# EAGLE design smd-to-breadboard2 (EAGLE 7.6.0)
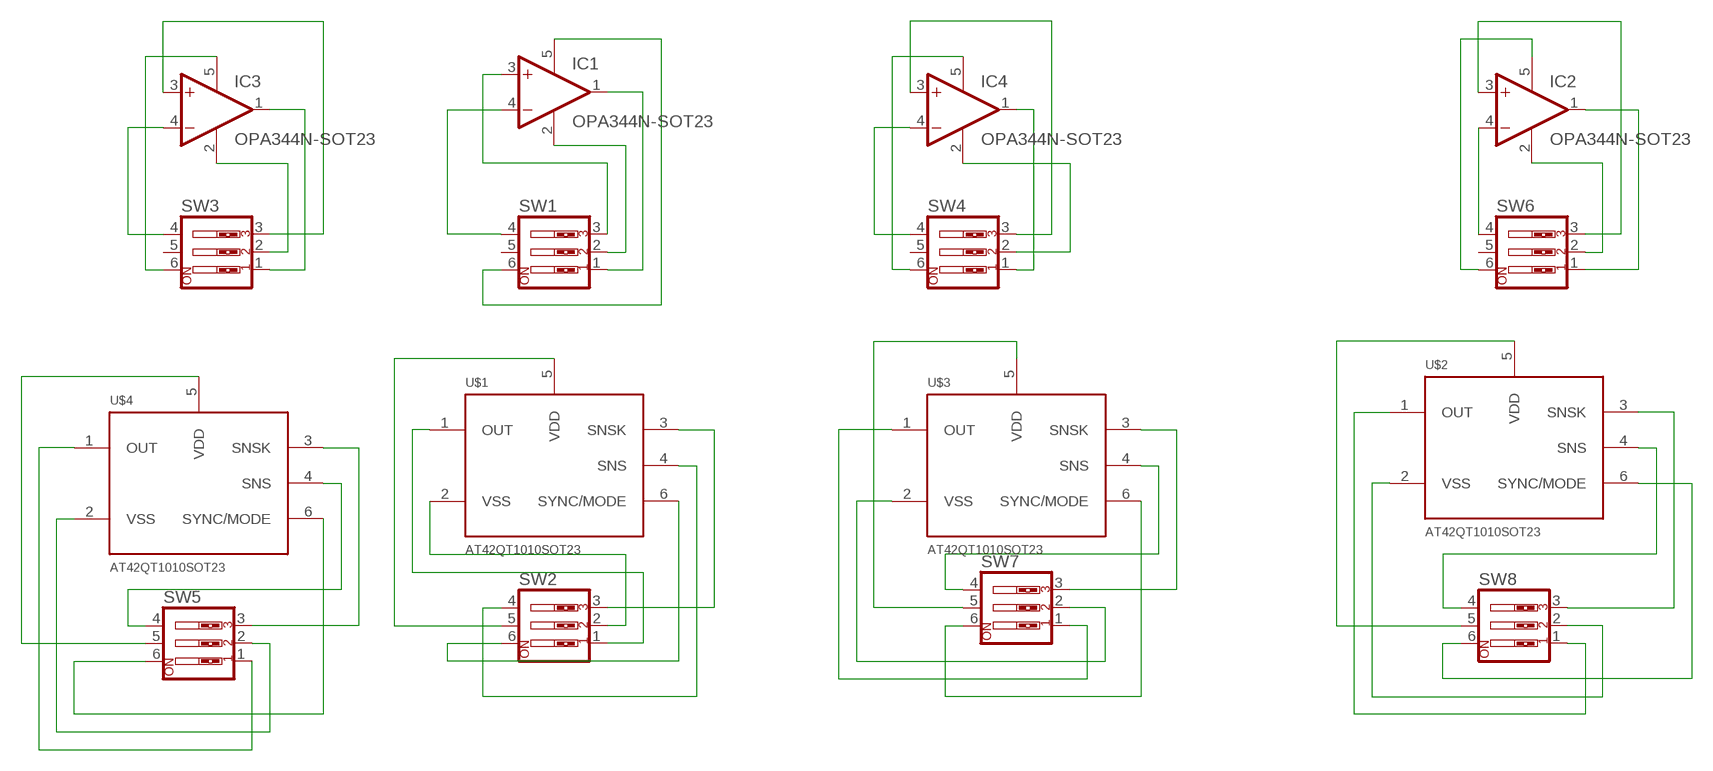
[diagram p0: schematic, sheet 1]

## Parts
IC1  OPA344N-SOT23  [SOT23-5]
IC2  OPA344N-SOT23  [SOT23-5]
IC3  OPA344N-SOT23  [SOT23-5]
IC4  OPA344N-SOT23  [SOT23-5]
SW1  SW_DIP-3  [EDG-03]
SW2  SW_DIP-3  [EDG-03]
SW3  SW_DIP-3  [EDG-03]
SW4  SW_DIP-3  [EDG-03]
SW5  SW_DIP-3  [EDG-03]
SW6  SW_DIP-3  [EDG-03]
SW7  SW_DIP-3  [EDG-03]
SW8  SW_DIP-3  [EDG-03]
U$1  AT42QT1010SOT23  [SOT23-6]
U$2  AT42QT1010SOT23  [SOT23-6]
U$3  AT42QT1010SOT23  [SOT23-6]
U$4  AT42QT1010SOT23  [SOT23-6]

## Nets
N$1: IC3.1(OUT) SW3.1
N$2: IC3.2(V-) SW3.2
N$3: IC3.3(+IN) SW3.3
N$4: IC3.5(V+) SW3.6
N$5: IC3.4(-IN) SW3.4
N$6: IC4.3(+IN) SW4.3
N$7: IC4.5(V+) SW4.6
N$8: IC4.4(-IN) SW4.4
N$9: IC4.1(OUT) SW4.1
N$10: IC1.1(OUT) SW1.1
N$11: IC1.2(V-) SW1.2
N$12: IC1.5(V+) SW1.6
N$13: IC1.3(+IN) SW1.3
N$14: IC1.4(-IN) SW1.4
N$15: SW2.1 U$1.1(OUT)
N$16: SW2.6 U$1.6(SYNC/MODE)
N$17: SW2.2 U$1.2(VSS)
N$18: SW2.4 U$1.4(SNS)
N$19: SW2.5 U$1.5(VDD)
N$20: SW2.3 U$1.3(SNSK)
N$21: IC4.2(V-) SW4.2
N$22: IC2.4(-IN) SW6.4
N$23: IC2.5(V+) SW6.6
N$24: IC2.3(+IN) SW6.3
N$25: IC2.1(OUT) SW6.1
N$26: IC2.2(V-) SW6.2
N$27: SW5.1 U$4.1(OUT)
N$28: SW5.2 U$4.2(VSS)
N$29: SW5.5 U$4.5(VDD)
N$30: SW5.6 U$4.6(SYNC/MODE)
N$31: SW5.4 U$4.4(SNS)
N$32: SW5.3 U$4.3(SNSK)
N$33: SW7.1 U$3.1(OUT)
N$34: SW7.2 U$3.2(VSS)
N$35: SW7.6 U$3.6(SYNC/MODE)
N$36: SW7.5 U$3.5(VDD)
N$37: SW7.4 U$3.4(SNS)
N$38: SW7.3 U$3.3(SNSK)
N$39: SW8.1 U$2.1(OUT)
N$40: SW8.2 U$2.2(VSS)
N$41: SW8.3 U$2.3(SNSK)
N$42: SW8.4 U$2.4(SNS)
N$43: SW8.5 U$2.5(VDD)
N$44: SW8.6 U$2.6(SYNC/MODE)
Unconnected: SW1.5 SW3.5 SW4.5 SW6.5

## Library data of the parts
IC1-IC4 = linear:OPA*-SOT23: Single Operational Amplifier Low Power, Single-Supply, Rail-To-Rail Operational Amplifier Source: http://focus.ti.com/lit/ds/symlink/opa2345.pdf
SW1-SW8 = special:SW_DIP-3: DIP SWITCH
U$1-U$4 = SparkFun-DigitalIC:AT42QT1010

## Board
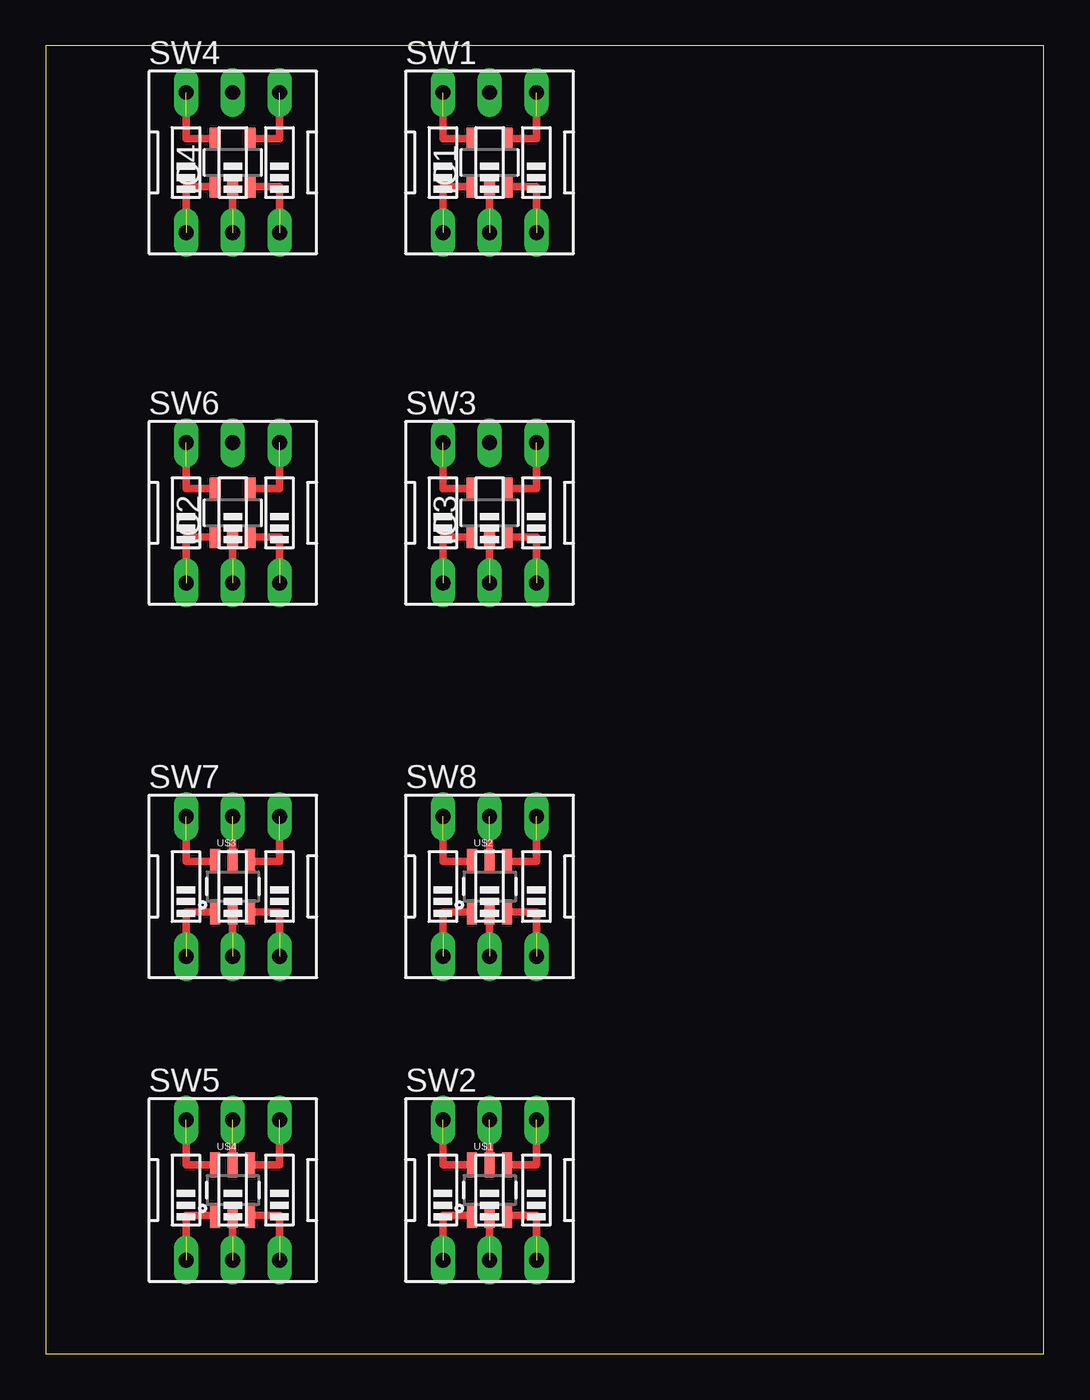
[diagram p1: board, top side]

Size 54.28 x 71.11 mm. Coordinates in mm from the lower left corner, seen from the top.
Outline: 0,0 54.28,0 54.28,71.11 0,71.11 0,0
Copper layers (1*16): Top 0.035mm / dielectric 1.5mm / Bottom 0.035mm
Design rules "default": minimum track width 10mil, minimum drill 24mil, track to track 8mil, track to pad 8mil, pad to pad 8mil, via to via 8mil, smd to smd 8mil, copper to edge 40mil, drill to drill 8mil, minimum pad ring 10mil, minimum via ring 8mil, stop-mask expansion 4mil, vias tented up to drill 0mil, thermal gap 10mil

### Footprints (pad centres in the part's own frame; a part is rotated, then mirrored left to right if it is on the bottom)
SOT23-5 = smd 0.6 x 1.2: 1 -0.95,-1.306; 2 0,-1.306; 3 0.95,-1.306; 4 0.95,1.306; 5 -0.95,1.306
EDG-03 = drill 0.813 long: 1 -2.54,-3.81; 2 0,-3.81; 3 2.54,-3.81; 4 2.54,3.81; 5 0,3.81; 6 -2.54,3.81
SOT23-6 = smd 0.55 x 1.35: 1 -0.95,-1.375; 2 0,-1.375; 3 0.95,-1.375; 4 0.95,1.375; 5 0,1.375; 6 -0.95,1.375

### Placement (x,y rotation side)
IC1  24.13,64.77 0 top
IC2  10.16,45.72 0 top
IC3  24.13,45.72 0 top
IC4  10.16,64.77 0 top
SW1  24.13,64.77 0 top
SW2  24.13,8.89 0 top
SW3  24.13,45.72 0 top
SW4  10.16,64.77 0 top
SW5  10.16,8.89 0 top
SW6  10.16,45.72 0 top
SW7  10.16,25.4 0 top
SW8  24.13,25.4 0 top
U$1  24.13,8.89 0 top
U$2  24.13,25.4 0 top
U$3  10.16,25.4 0 top
U$4  10.16,8.89 0 top

### Tracks (layer width: path | path; a pad name or v marks a point on that pad's centre or on a via)
N$1  (1 unrouted)
  Top 0.406: IC3.1 21.59,44.41 21.59,43.18
N$2  (1 unrouted)
  Top 0.406: IC3.2 24.13,43.18
N$3  (1 unrouted)
  Top 0.406: IC3.3 26.67,44.41 26.67,43.18
N$4  (1 unrouted)
  Top 0.406: IC3.5 21.59,47.03 21.59,48.26
N$5  (1 unrouted)
  Top 0.406: IC3.4 26.67,47.03 26.67,48.26
N$6  (1 unrouted)
  Top 0.406: IC4.3 12.7,63.46 12.7,62.23
N$7  (1 unrouted)
  Top 0.406: IC4.5 7.62,66.08 7.62,67.31
N$8  (1 unrouted)
  Top 0.406: IC4.4 12.7,66.08 12.7,67.31
N$9  (1 unrouted)
  Top 0.406: IC4.1 7.62,63.46 7.62,62.23
N$10  (1 unrouted)
  Top 0.406: IC1.1 21.59,63.46 21.59,62.23
N$11  (1 unrouted)
  Top 0.406: IC1.2 24.13,62.23
N$12  (1 unrouted)
  Top 0.406: IC1.5 21.59,66.08 21.59,67.31
N$13  (1 unrouted)
  Top 0.406: IC1.3 26.67,63.46 26.67,62.23
N$14  (1 unrouted)
  Top 0.406: IC1.4 26.67,66.08 26.67,67.31
N$15  (1 unrouted)
  Top 0.406: U$1.1 21.59,7.52 21.59,6.35
N$16  (1 unrouted)
  Top 0.406: U$1.6 21.59,10.27 21.59,11.43
N$17  (1 unrouted)
  Top 0.406: U$1.2 24.13,6.35
N$18  (1 unrouted)
  Top 0.406: U$1.4 26.67,10.27 26.67,11.43
N$19  (1 unrouted)
  Top 0.406: U$1.5 24.13,11.43
N$20  (1 unrouted)
  Top 0.406: U$1.3 26.67,7.52 26.67,6.35
N$21  (1 unrouted)
  Top 0.406: IC4.2 10.16,62.23
N$22  (1 unrouted)
  Top 0.406: IC2.4 12.7,47.03 12.7,48.26
N$23  (1 unrouted)
  Top 0.406: IC2.5 7.62,47.03 7.62,48.26
N$24  (1 unrouted)
  Top 0.406: IC2.3 12.7,44.41 12.7,43.18
N$25  (1 unrouted)
  Top 0.406: IC2.1 7.62,44.41 7.62,43.18
N$26  (1 unrouted)
  Top 0.406: IC2.2 10.16,43.18
N$27  (1 unrouted)
  Top 0.406: U$4.1 7.62,7.52 7.62,6.35
N$28  (1 unrouted)
  Top 0.406: U$4.2 10.16,6.35
N$29  (1 unrouted)
  Top 0.406: U$4.5 10.16,11.43
N$30  (1 unrouted)
  Top 0.406: U$4.6 7.62,10.27 7.62,11.43
N$31  (1 unrouted)
  Top 0.406: U$4.4 12.7,10.27 12.7,11.43
N$32  (1 unrouted)
  Top 0.406: U$4.3 12.7,7.52 12.7,6.35
N$33  (1 unrouted)
  Top 0.406: U$3.1 7.62,24.02 7.62,22.86
N$34  (1 unrouted)
  Top 0.406: U$3.2 10.16,22.86
N$35  (1 unrouted)
  Top 0.406: U$3.6 7.62,26.77 7.62,27.94
N$36  (1 unrouted)
  Top 0.406: U$3.5 10.16,27.94
N$37  (1 unrouted)
  Top 0.406: U$3.4 12.7,26.77 12.7,27.94
N$38  (1 unrouted)
  Top 0.406: U$3.3 12.7,24.02 12.7,22.86
N$39  (1 unrouted)
  Top 0.406: U$2.1 21.59,24.02 21.59,22.86
N$40  (1 unrouted)
  Top 0.406: U$2.2 24.13,22.86
N$41  (1 unrouted)
  Top 0.406: U$2.3 26.67,24.02 26.67,22.86
N$42  (1 unrouted)
  Top 0.406: U$2.4 26.67,26.77 26.67,27.94
N$43  (1 unrouted)
  Top 0.406: U$2.5 24.13,27.94
N$44  (1 unrouted)
  Top 0.406: U$2.6 21.59,26.77 21.59,27.94